# EAGLE design Phiips 212 r2 (EAGLE 9.2.2)
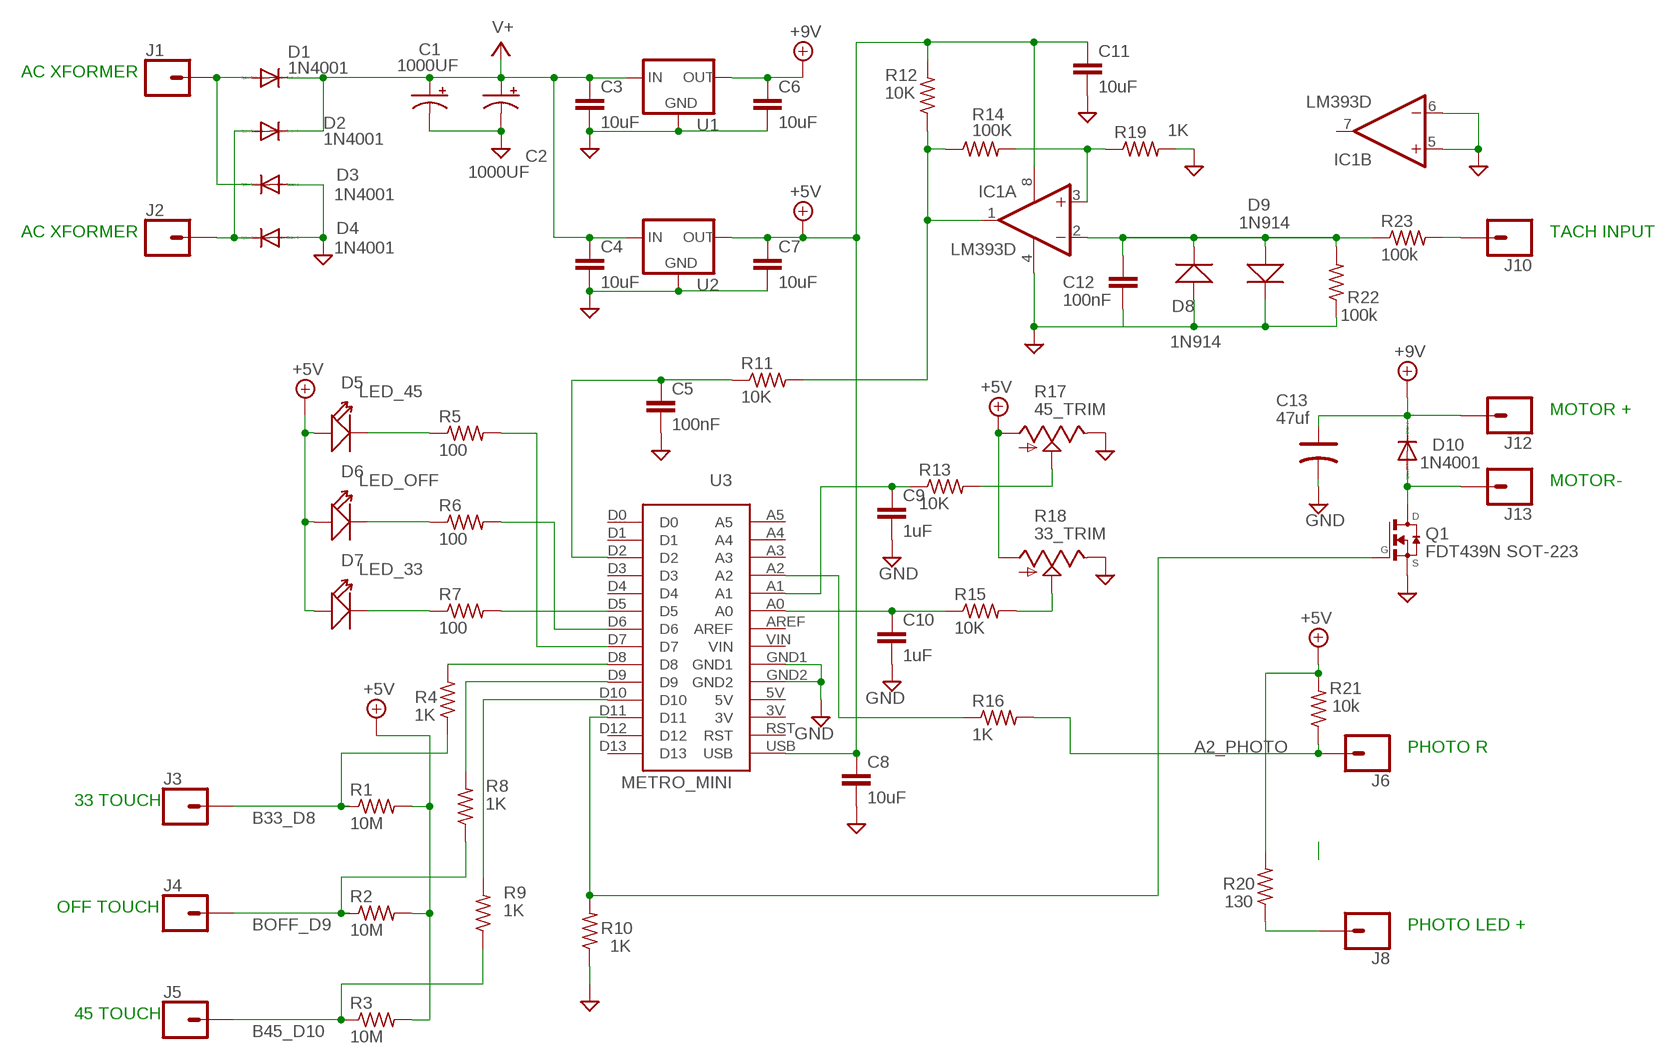
[diagram p0: schematic, sheet 1]

## Parts
C1  1000UF  [CAPPAD1700W60L1040D500P]
C2  1000UF  [CAPPAD1700W60L1040D500P]
C3  10uF  10UF-1206-6.3V-20%  [1206]
C4  10uF  10UF-1206-6.3V-20%  [1206]
C5  100nF  10UF-0805-10V-10%  [0805]
C6  10uF  10UF-1206-6.3V-20%  [1206]
C7  10uF  10UF-1206-6.3V-20%  [1206]
C8  10uF  10UF-1206-6.3V-20%  [1206]
C9  1uF  10UF-1206-6.3V-20%  [1206]
C10  1uF  10UF-1206-6.3V-20%  [1206]
C11  10uF  10UF-1206-6.3V-20%  [1206]
C12  100nF  10UF-0805-10V-10%  [0805]
C13  47uf  TANTALUM-SMD-470UF-6.3V(AVX-D)  [AVX-D]
D1  1N4001  1N4004  [DO41-10]
D2  1N4001  1N4004  [DO41-10]
D3  1N4001  1N4004  [DO41-10]
D4  1N4001  1N4004  [DO41-10]
D5  LED_45  DIP-LED-TRANSPARENT-WHITE(2P-D5MM)  [LED2-2.54-D5.0MM]
D6  LED_OFF  DIP-LED-TRANSPARENT-WHITE(2P-D5MM)  [LED2-2.54-D5.0MM]
D7  LED_33  DIP-LED-TRANSPARENT-WHITE(2P-D5MM)  [LED2-2.54-D5.0MM]
D8  1N914  DIP-DIODE-400V-1A(DO-41)  [DO-41]
D9  1N914  DIP-DIODE-400V-1A(DO-41)  [DO-41]
D10  1N4001  1N4004  [DO41-10]
IC1  LM393D  [SO08]
J1  CONN_01OFFSET  [1X01_OFFSET]
J2  CONN_01OFFSET  [1X01_OFFSET]
J3  CONN_01OFFSET  [1X01_OFFSET]
J4  CONN_01OFFSET  [1X01_OFFSET]
J5  CONN_01OFFSET  [1X01_OFFSET]
J6  CONN_01OFFSET  [1X01_OFFSET]
J8  CONN_01OFFSET  [1X01_OFFSET]
J10  CONN_01OFFSET  [1X01_OFFSET]
J12  CONN_01OFFSET  [1X01_OFFSET]
J13  CONN_01OFFSET  [1X01_OFFSET]
Q1  FDT439N SOT-223  FDT439NSOT-223  [SOT-223]
R1  10M  R-US_M1206  [M1206]
R2  10M  R-US_M1206  [M1206]
R3  10M  R-US_M1206  [M1206]
R4  1K  R-US_M1206  [M1206]
R5  100  R-US_M1206  [M1206]
R6  100  R-US_M1206  [M1206]
R7  100  R-US_M1206  [M1206]
R8  1K  R-US_M1206  [M1206]
R9  1K  R-US_M1206  [M1206]
R10  1K  R-US_M1206  [M1206]
R11  10K  R-US_M1206  [M1206]
R12  10K  R-US_M1206  [M1206]
R13  10K  R-US_M1206  [M1206]
R14  100K  R-US_M1206  [M1206]
R15  10K  R-US_M1206  [M1206]
R16  1K  R-US_M1206  [M1206]
R17  45_TRIM  POTS212_POT  [PH212_POT]
R18  33_TRIM  POTS212_POT  [PH212_POT]
R19  1K  R-US_M1206  [M1206]
R20  130  R-US_M1206  [M1206]
R21  10k  R-US_M1206  [M1206]
R22  100k  R-US_M1206  [M1206]
R23  100k  R-US_M1206  [M1206]
U1  V_REG_78XXSIDE  [78XXL]
U2  V_REG_78XXSIDE  [78XXL]
U3  METRO_MINI  [METRO_MINI]

## Nets
+5V: C7.1 C8.1 C11.1 D5.+ D6.+ D7.+ IC1.8(P:V+) R1.2 R2.2 R3.2 R12.2 R17.1(A) R18.1(A) R20.2 R21.2 U2.OUT U3.USB
+9V: C6.1 C13.+ D10.C J12.1 U1.OUT
A0: R15.2 R18.2(S)
A0N: C10.1 R15.1 U3.A0
A1: R13.2 R17.2(S)
A1N: C9.1 R13.1 U3.A1
A2_PHOTO: J6.1 R16.2 R21.1
B33_D8: J3.1 R1.1 R4.1
B45_D10: J5.1 R3.1 R9.1
BOFF_D9: J4.1 R2.1 R8.1
CIN+: IC1.3(A:+IN) R14.2 R19.1
CIN-: C12.1 D8.2(-) D9.1(+) IC1.2(A:-IN) R22.2 R23.1
CMPOUT: IC1.1(A:OUT) R11.2 R12.1 R14.1
D2: C5.1 R11.1 U3.D2
D8: R4.2 U3.D8
D9: R8.2 U3.D9
D10: R9.2 U3.D10
D10_GATE: Q1.1(G) R10.2 U3.D11
GND: C1.2(-) C2.2(-) C3.2 C4.2 C5.2 C6.2 C7.2 C8.2 C9.2 C10.2 C11.2 C12.2 C13.- D3.A D4.A D8.1(+) D9.2(-) IC1.4(P:V-) IC1.5(B:+IN) IC1.6(B:-IN) Q1.3(S) R10.1 R17.3(E) R18.3(E) R19.2 R22.1 U1.GND U2.GND U3.GND1 U3.GND2
L33: D7.- R7.1
L45: D5.- R5.1
L45_D7: R5.2 U3.D7
LOFF: D6.- R6.1
LOFF_D6: R6.2 U3.D6
MOTR-: D10.A J13.1 Q1.2(D) Q1.4(D)
N$1: R7.2 U3.D5
N$2: R16.1 U3.A2
N$3: J8.1 R20.1
N$4: D1.A D3.C J1.1
N$6: D2.A D4.C J2.1
TACH: J10.1 R23.2
V+: C1.1(+) C2.1(+) C3.1 C4.1 D1.C D2.C U1.IN U2.IN
Unconnected: IC1.7(B:OUT) U3.3V U3.5V U3.A3 U3.A4 U3.A5 U3.AREF U3.D0 U3.D1 U3.D3 U3.D4 U3.D12 U3.D13 U3.RST U3.VIN

## Notes on the sheet
- AC XFORMER
- AC XFORMER | TACH INPUT
- MOTOR +
- MOTOR-
- PHOTO R
- 33 TOUCH
- OFF TOUCH
- PHOTO LED +
- 45 TOUCH

## Library data of the parts
C1 C2 = Bioelec:1000UF: 1,000µF/1mF ceramic capacitors A capacitor is a passive two-terminal electrical component used to store electrical energy temporarily in an electric field. CAP-08070
C3 C4 C6-C8 C11 = SparkFun-Capacitors:10UF: 10.0µF ceramic capacitors A capacitor is a passive two-terminal electrical component used to store electrical energy temporarily in an electric field.; PROD_ID: CAP-10057
C5 C12 = SparkFun-Capacitors:10UF: 10.0µF ceramic capacitors A capacitor is a passive two-terminal electrical component used to store electrical energy temporarily in an electric field.; PROD_ID: CAP-11330; VALUE: 10uF
C9 C10 = SparkFun-Capacitors:10UF: 10.0µF ceramic capacitors A capacitor is a passive two-terminal electrical component used to store electrical energy temporarily in an electric field.; PROD_ID: CAP-10057; VALUE: 10uF
C13 = Seeed-Capacitor:TANTALUM-SMD-470UF-6.3V(AVX-D): 302020027; MPN: TAJD477*006#NJ; VALUE: 470uf
D1-D4 D10 = diode:1N4004: DIODE general purpose rectifier, 1 A
D5-D7 = Seeed-LED:DIP-LED-TRANSPARENT-WHITE(2P-D5MM): 304090058; MPN: 504WC; VALUE: 504WC
D8 D9 = Seeed-Diode:DIP-DIODE-400V-1A(DO-41): 304010008; MPN: 1N4004; VALUE: 1N4004
IC1 = linear:LM393: COMPARATOR
J1-J6 J8 J10 J12 J13 = SparkFun-Connectors:CONN_01: Single connection point. Often used as Generic Header-pin footprint for 0.1 inch spaced/style header connections On any of the 0.1 inch spaced packages, you can populate with these: Break Away Headers - Straight <https://www.sparkfun.com/products/116> (PRT-00116) Break Away Male Headers - Right Angle <https://www.sparkfun.com/products/553> (PRT-00553) Female Headers <https://www.sparkfun.com/products/115> (PRT-00115) Break Away Headers - Machine Pin <https://www.sparkfun.com/products/117> (PRT-00117) Break Away Female Headers - Swiss Machine Pin <https://www.sparkfun.com/products/743> (PRT-00743) This device is also useful as a general connection point to wire up your design to another part of your project. Our various solder wires solder well into these plated through hole pads. Hook-Up Wire - Assortment (Stranded, 22 AWG) <https://www.sparkfun.com/products/11375> (PRT-11375) Hook-Up Wire - Assortment (Solid Core, 22 AWG) <https://www.sparkfun.com/products/11367> (PRT-11367) View the entire wire category on our website here <https://www.sparkfun.com/categories/141> Special notes: SMTSO-256-ET is a "flush mount" nut for a 4-40 screw. We mostly use this on specialty testbeds; it is a nice way to connect hardware to your PCB at an adjustable hieght. Also note, the SNAP packages are for using a snappable style connector. We sell a baggie of snaps and they are also used on two LilyPad designs: Snap Assortment - 30 pack (male and female) <https://www.sparkfun.com/products/11347> (DEV-11347) LilyPad Arduino SimpleSnap <https://www.sparkfun.com/products/10941> (DEV-10941) LilyPad SimpleSnap Protoboard <https://www.sparkfun.com/products/10940> (DEV-10940)
Q1 = Bioelec:FDT439N: N-Channel MOSFET Logic Level Enhancement Mode Field Effect Transistor
R1-R16 R19-R23 = resistor:R-US_: RESISTOR, American symbol
R17 R18 = Len Misc:POTS: Misc potentiometers
U1 U2 = SparkFun-IC-Power:V_REG_78XX: Voltage Regulator Standard 78xx regulator. IGO (Input Ground Output). Spark Fun Electronics SKU : COM-00107
U3 = Len Misc:METRO_MINI: Footprint for Adafruit Metro Mini Arduino compatible board

## Board
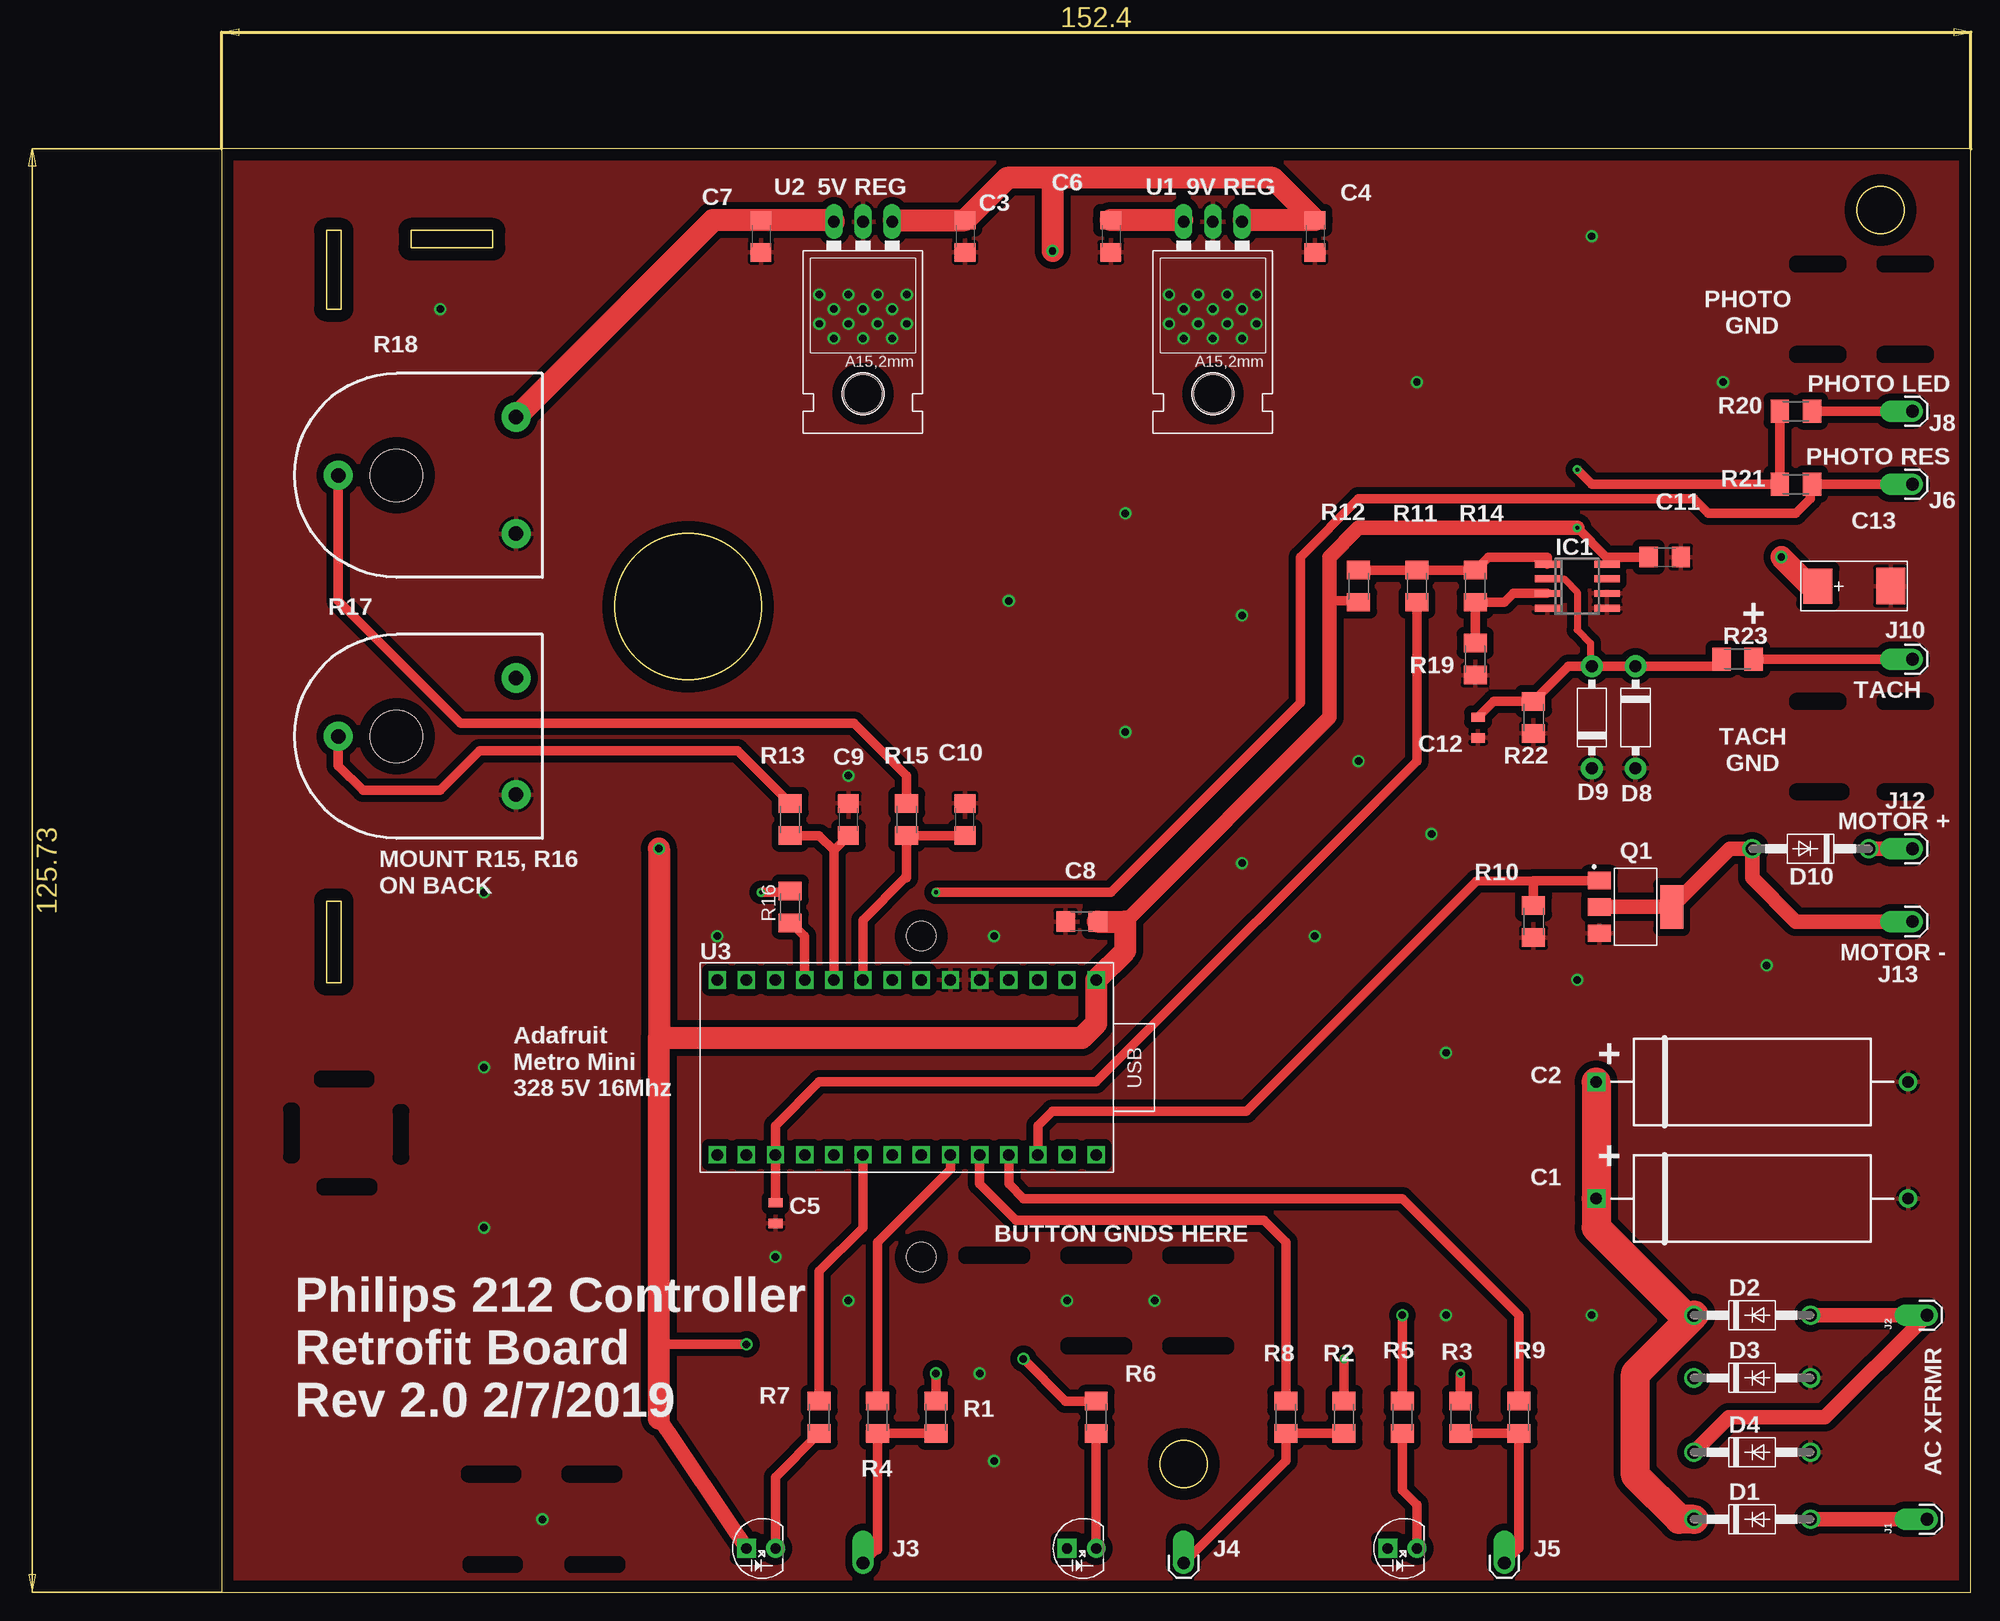
[diagram p1: board, top side]
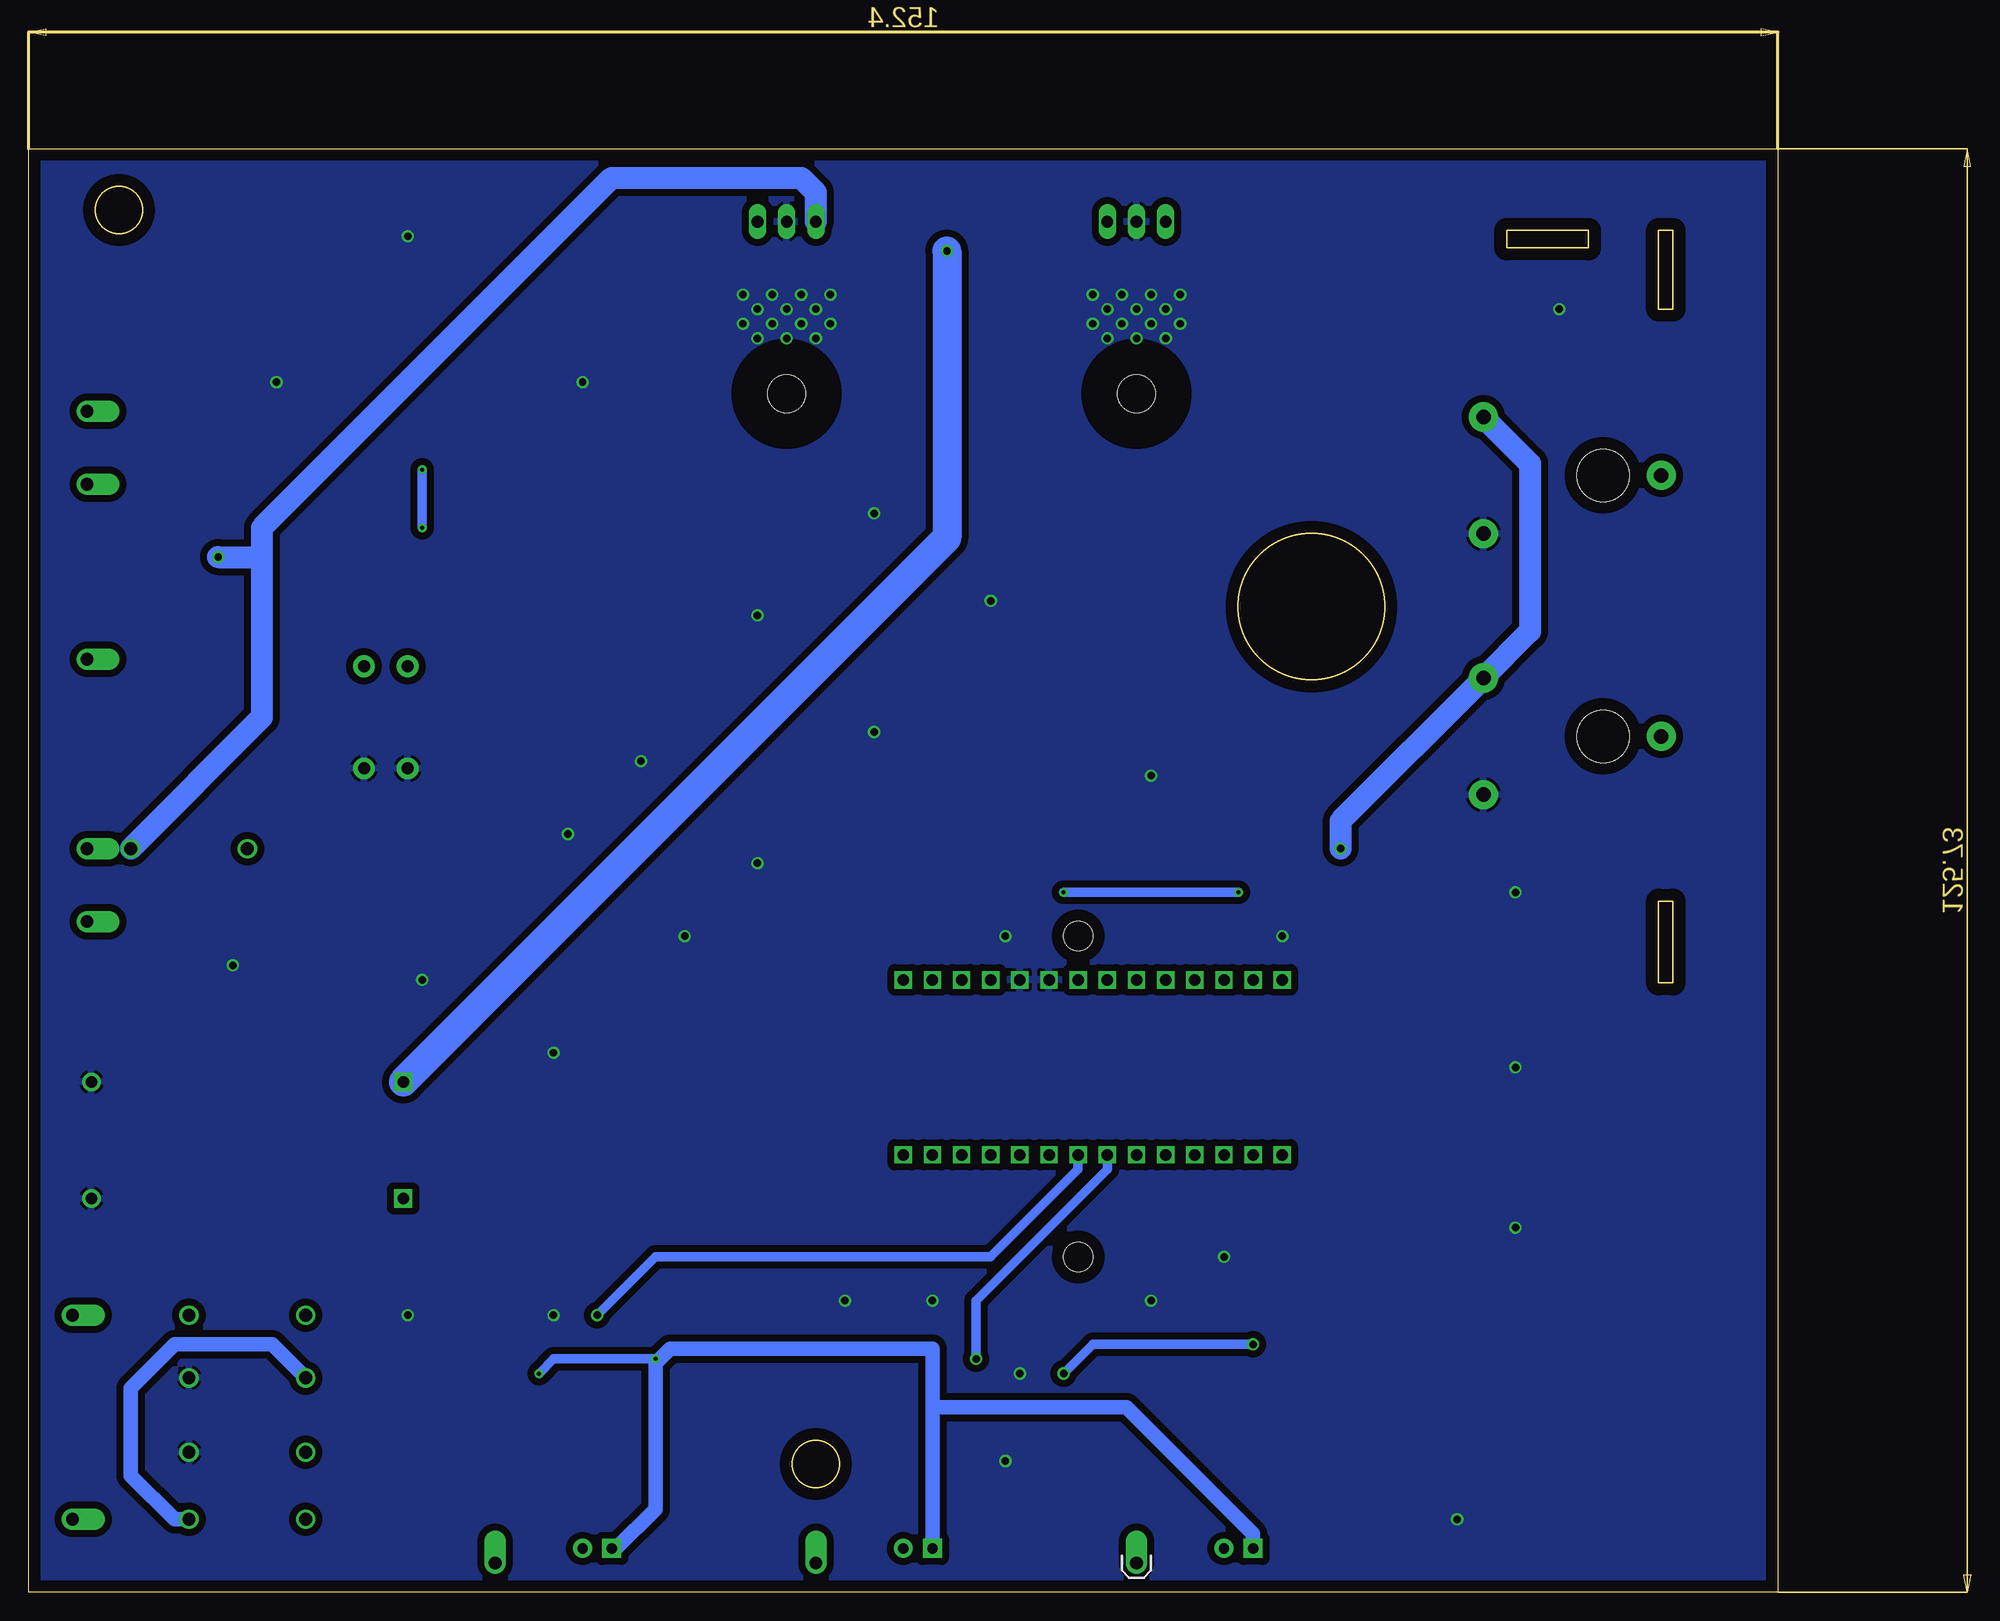
[diagram p2: board, bottom side, seen from below]

Size 152.4 x 125.73 mm. Coordinates in mm from the lower left corner, seen from the top.
Outline: 0,0 152.4,0 152.4,125.73 0,125.73 0,0
Outline: 9.14,118.62 9.14,111.76 10.41,111.76 10.41,118.62 9.14,118.62
Outline: 16.51,118.62 16.51,117.09 23.62,117.09 23.62,118.62 16.51,118.62
Outline: 9.14,60.2 9.14,53.09 10.41,53.09 10.41,60.2 9.14,60.2
Outline: circle at 40.64,85.85 radius 6.35
Outline: circle at 144.53,120.4 radius 2.03
Outline: circle at 83.82,11.18 radius 2.03
Copper layers (1*16): Top 0.035mm / dielectric 1.5mm / Bottom 0.035mm
Design rules "default": minimum track width 6mil, minimum drill 0.35mm, track to track 6mil, track to pad 6mil, pad to pad 6mil, via to via 6mil, smd to smd 6mil, copper to edge 40mil, drill to drill 6mil, minimum pad ring 10mil, minimum via ring 8mil, stop-mask expansion 4mil, vias tented up to drill 0mil, thermal gap 10mil
Holes 4.57 mm at 15.24,97.28 15.24,74.55
Holes 2.54 mm at 60.96,29.21 60.96,57.15
tRestrict: area 144.8,115.6 to 148.6,115.8; area 137.2,115.6 to 141,115.8; area 137.2,107.7 to 141,108; area 144.8,107.7 to 148.6,108; area 144.8,77.5 to 148.6,77.7; area 137.2,77.5 to 141,77.7; area 137.2,69.6 to 141.2,69.8; area 144.8,69.6 to 148.6,69.8; area 82.6,29.2 to 87.6,29.5; area 73.7,29.2 to 78.7,29.5; area 73.7,21.3 to 78.7,21.6; area 82.6,21.3 to 87.6,21.6; area 64.8,29.2 to 69.8,29.5; area 21.6,2.3 to 25.7,2.5; area 30.5,2.3 to 34.5,2.5; area 21.5,10.2 to 25.5,10.4; area 30.2,10.2 to 34.3,10.4; area 8.6,44.6 to 12.7,44.8; area 8.9,35.2 to 13,35.4; area 15.5,37.8 to 15.7,41.9; area 6,38 to 6.2,42

### Footprints (pad centres in the part's own frame; a part is rotated, then mirrored left to right if it is on the bottom)
CAPPAD1700W60L1040D500P = drill 1 pad 1.6 square: 1 -13.58,0 | drill 1 pad 1.6: 2 13.58,0
1206 = smd 1.6 x 1.8: 1 -1.4,0; 2 1.4,0
0805 = smd 0.8 x 1.2: 1 -0.9,0; 2 0.9,0
AVX-D = smd 2.54 x 3.048: + -3.175,0 | smd 2.54 x 3.175: - 3.175,0
DO41-10 = drill 1.118: A 5.08,0; C -5.08,0
LED2-2.54-D5.0MM = drill 0.889 pad 1.651 square: + -1.27,0 | drill 0.889 pad 1.651: - 1.27,0
DO-41 = drill 1.041 pad 1.905: 1 -4.445,0; 2 4.445,0
SO08 = smd 0.6 x 2.2: 1 -1.905,-2.6; 2 -0.635,-2.6; 3 0.635,-2.6; 4 1.905,-2.6; 5 1.905,2.6; 6 0.635,2.6; 7 -0.635,2.6; 8 -1.905,2.6
1X01_OFFSET = drill 1.118 pad 1.88 offset: 1 0,0
SOT-223 = smd 1.5 x 2: 1 -2.3,-3.15; 2 0,-3.15; 3 2.3,-3.15 | smd 3.8 x 2: 4 0,3.15
M1206 = smd 1.6 x 2: 1 -1.4,0; 2 1.4,0
PH212_POT = drill 1.27 pad 2.54: 1 -5.08,10.414; 2 0,-5.08; 3 5.08,10.414
78XXL = drill 1.016 long: GND 0,-3.81; IN -2.54,-3.81; OUT 2.54,-3.81 | hole 3.302: 0,11.176
METRO_MINI = drill 1 square: 3V 11.43,7.62; 5V 8.89,7.62; A0 -3.81,7.62; A1 -6.35,7.62; A2 -8.89,7.62; A3 -11.43,7.62; A4 -13.97,7.62; A5 -16.51,7.62; AREF -1.27,7.62; D0 -16.51,-7.62; D1 -13.97,-7.62; D2 -11.43,-7.62; D3 -8.89,-7.62; D4 -6.35,-7.62; D5 -3.81,-7.62; D6 -1.27,-7.62; D7 1.27,-7.62; D8 3.81,-7.62; D9 6.35,-7.62; D10 8.89,-7.62; D11 11.43,-7.62; D12 13.97,-7.62; D13 16.51,-7.62; GND1 3.81,7.62; GND2 6.35,7.62; RST 13.97,7.62; USB 16.51,7.62; VIN 1.27,7.62

### Placement (x,y rotation side)
C1  133.35,34.29 0 top
C2  133.35,44.45 0 top
C3  64.77,118.11 270 top
C4  95.25,118.11 270 top
C5  48.26,33.02 270 top
C6  77.47,118.11 270 top
C7  46.99,118.11 270 top
C8  74.93,58.42 180 top
C9  54.61,67.31 90 top
C10  64.77,67.31 90 top
C11  125.73,90.17 0 top
C12  109.47,75.31 270 top
C13  142.24,87.63 0 top
D1  133.35,6.35 0 top
D2  133.35,24.13 0 top
D3  133.35,18.67 0 top
D4  133.35,12.19 0 top
D5  102.87,3.81 0 top
D6  74.93,3.81 0 top
D7  46.99,3.81 0 top
D8  123.19,76.2 90 top
D9  119.38,76.2 270 top
D10  138.43,64.77 180 top
IC1  118.11,87.63 270 top
J1  148.59,6.35 90 top
J2  148.59,24.13 90 top
J3  55.88,2.54 0 bottom
J4  83.82,2.54 0 top
J5  111.76,2.54 0 top
J6  147.32,96.52 90 top
J8  147.32,102.87 90 top
J10  147.32,81.28 90 top
J12  147.32,64.77 90 top
J13  147.32,58.42 90 top
Q1  123.19,59.69 270 top
R1  62.23,15.24 90 top
R2  97.79,15.24 90 top
R3  107.95,15.24 90 top
R4  57.15,15.24 90 top
R5  102.87,15.24 90 top
R6  76.2,15.24 90 top
R7  52.07,15.24 90 top
R8  92.71,15.24 90 top
R9  113.03,15.24 90 top
R10  114.3,58.42 90 top
R11  104.14,87.63 90 top
R12  99.06,87.63 270 top
R13  49.53,67.31 90 top
R14  109.22,87.63 270 top
R15  59.69,67.31 90 top
R16  49.53,59.69 90 top
R17  15.24,74.55 270 top
R18  15.24,97.28 270 top
R19  109.22,81.28 270 top
R20  137.16,102.87 180 top
R21  137.16,96.52 180 top
R22  114.3,76.2 90 top
R23  132.08,81.28 0 top
U1  86.36,115.57 180 top
U2  55.88,115.57 180 top
U3  59.69,45.72 0 top

### Tracks (layer width: path | path; a pad name or v marks a point on that pad's centre or on a via)
+5V  (via drill 0.35, 0.65)
  Top 0.61: 120.71,90.11 IC1.8
  Top 0.813: v45.72,21.59 38.1,21.59 | v62.23,19.05 R1.2 | 120.65,90.17 C11.1 | 120.65,90.17 v118.11,92.71 | 120.65,90.17 120.71,90.11 | R12.2 98.93,86.36 96.52,86.36 | R3.2 v107.95,19.05 | R2.2 v97.79,20.32 | R20.2 R21.2 119.38,96.52 v118.11,97.79
  Top 1.27: D7.+ 38.1,15.14 | 78.74,58.42 96.52,76.2 96.52,86.36 96.52,90.17 99.06,92.71 v118.11,92.71
  Top 1.905: 38.1,15.14 38.1,21.59 38.1,48.26 | C8.1 78.74,58.42 78.74,55.88 U3.USB 76.2,49.53 74.93,48.26 38.1,48.26 | U2.OUT 53.21,119.51 C7.1 42.8,119.51 R18.1 | v38.1,64.77 38.1,48.26
  Bottom 0.813: v62.23,19.05 59.69,21.59 v45.72,21.59 | 97.41,20.32 v97.79,20.32 106.68,20.32 v107.95,19.05 | v118.11,97.79 v118.11,92.71
  Bottom 1.27: D5.+ 101.22,3.81 97.79,7.24 97.79,19.94 97.41,20.32 96.52,21.21 73.66,21.21 73.66,16.13 | D6.+ 73.66,16.13 | D7.+ 45.72,5.08 56.77,16.13 73.66,16.13
  Bottom 1.905: R18.1 21.59,98.3 21.59,83.69 R17.1 38.1,67.18 v38.1,64.77
+9V  (via drill 0.65)
  Top 1.27: U1.OUT 83.69,119.51 | J12.1 D10.C
  Top 1.905: 83.69,119.51 C6.1 | C13.+ 138.43,87.63 v135.89,90.17
  Bottom 1.905: D10.C 132.08,76.2 132.08,90.17 | 132.08,90.17 132.08,92.71 101.6,123.19 85.09,123.19 83.82,121.92 U1.OUT | v135.89,90.17 132.08,90.17
A0
  Top 0.813: R18.2 10.16,86.36 20.83,75.69 55.12,75.69 59.69,71.12 R15.2
A0N
  Top 0.813: U3.A0 55.88,58.55 59.56,62.23 59.69,62.23 R15.1 C10.1
A1
  Top 0.813: R13.2 44.96,73.28 22.48,73.28 19.05,69.85 12.32,69.85 10.16,72.01 R17.2
A1N
  Top 0.813: C9.1 53.34,64.64 | U3.A1 53.34,64.64 | 53.34,64.64 52.07,65.91 R13.1
A2_PHOTO  (via drill 0.35)
  Top 0.813: R16.2 49.4,60.96 v46.99,60.96 | v62.23,60.96 77.47,60.96 93.98,77.47 93.98,90.17 99.06,95.25 128.27,95.25 129.54,93.98 137.16,93.98 138.43,95.25 138.43,96.39 R21.1 J6.1
  Bottom 0.813: v46.99,60.96 v62.23,60.96
B33_D8
  Top 0.813: R1.1 R4.1 57.15,3.68 57.02,3.68 J3.1
B45_D10
  Top 0.813: R9.1 113.03,3.81 J5.1 | 113.03,13.97 R9.1 | R3.1 R9.1
BOFF_D9
  Top 0.813: R8.1 92.71,11.43 J4.1 | R8.1 92.71,13.97 | R8.1 R2.1
CIN+
  Top 0.813: IC1.3 112.53,87 111.76,86.23 R14.2 R19.1
CIN-
  Top 0.61: IC1.2 116.97,88.27 118.11,87.12 118.11,83.82 119.25,82.68 119.25,80.65
  Top 0.813: D9.1 D8.2 130.04,80.65 R23.1 | 119.25,80.65 D9.1 | C12.1 110.86,77.6 R22.2 117.34,80.65 D9.1
CMPOUT
  Top 0.813: IC1.1 115.51,90.17 110.36,90.17 R14.1 R11.2 R12.1
D2
  Top 0.813: C5.1 U3.D2 48.26,40.64 52.07,44.45 76.2,44.45 104.14,72.39 R11.1
D8
  Top 0.813: U3.D8 63.5,36.83 57.15,30.48 R4.2
D9
  Top 0.813: U3.D9 66.04,35.56 69.22,32.39 90.81,32.39 92.71,30.48 R8.2
D10
  Top 0.813: U3.D10 68.58,35.56 69.85,34.29 102.87,34.29 113.03,24.13 R9.2
D10_GATE
  Top 0.813: Q1.1 114.3,61.96 | 114.3,61.96 109.31,61.94 89.28,41.91 72.39,41.91 71.12,40.64 U3.D11 | R10.2 114.3,61.96
GND  (via drill 0.65)
  other vias: 22.86,60.96 22.86,45.72 22.86,31.75 27.94,6.35 106.68,24.13 106.68,46.99 88.9,85.09 68.58,86.36 78.74,93.98 99.06,72.39 78.74,74.93 59.69,113.03 104.14,105.41 95.25,57.15 48.26,29.21 54.61,25.4 81.28,25.4 88.9,63.5 105.41,66.04 118.11,53.34 119.38,118.11 130.81,105.41 119.38,24.13 67.31,11.43 54.61,71.12 134.62,54.61 54.61,113.03 57.15,113.03 53.34,111.76 55.88,111.76 58.42,111.76 52.07,113.03 59.69,110.49 54.61,110.49 57.15,110.49 53.34,109.22 55.88,109.22 58.42,109.22 52.07,110.49 85.09,113.03 83.82,111.76 86.36,111.76 82.55,113.03 90.17,110.49 85.09,110.49 87.63,110.49 83.82,109.22 86.36,109.22 88.9,109.22 82.55,110.49 87.63,113.03 90.17,113.03 88.9,111.76 66.04,19.05 73.66,25.4 67.31,57.15 43.18,57.15 19.05,111.76
  pour Top (isolate 0.61): 0,125.73 0,0 152.4,0 152.4,125.73
  pour Bottom (isolate 0.61): 0,125.73 0,0 152.4,0 152.4,125.73
L33
  Top 0.813: R7.1 48.26,10.03 D7.-
L45
  Top 0.813: D5.- 104.14,7.62 102.87,8.89 R5.1
L45_D7  (via drill 0.65)
  Top 0.813: v102.87,24.13 R5.2
  Bottom 0.813: U3.D7 60.96,36.83 68.58,29.21 97.79,29.21 v102.87,24.13
LOFF
  Top 0.813: R6.1 | R6.1 D6.-
LOFF_D6  (via drill 0.65)
  Top 0.813: R6.2 73.53,16.64 v69.85,20.32
  Bottom 0.813: U3.D6 58.42,36.83 69.85,25.4 v69.85,20.32
MOTR-
  Top 1.27: Q1.2 Q1.4 131.42,64.77 D10.A 133.35,62.23 137.16,58.42 J13.1
N$1
  Top 0.813: R7.2 52.07,27.94 55.88,31.75 U3.D5
N$2
  Top 0.813: U3.A2 50.8,57.15 49.66,58.29 R16.1
N$3
  Top 0.813: R20.1 J8.1
N$4
  Top 1.27: D1.A J1.1
  Bottom 1.27: D3.C 131.19,21.59 139.7,21.59 143.51,17.78 143.51,10.16 139.7,6.35 D1.A
N$6
  Top 1.27: D4.C 131.32,15.24 139.7,15.24 J2.1 D2.A
TACH
  Top 0.813: J10.1 R23.2
V+  (via drill 0.65)
  Top 1.27: U1.IN 89.03,119.51 | U2.IN 58.55,119.51
  Top 1.905: 89.03,119.51 C4.1 91.57,123.19 72.39,123.19 | 58.55,119.51 C3.1 68.45,123.19 72.39,123.19 | 72.39,123.19 v72.39,116.84
  Top 2.54: D1.C 127,6.35 123.19,10.16 123.19,19.05 D2.C 127.39,24.13 119.77,31.75 C1.1 C2.1
  Bottom 2.54: C2.1 72.39,91.83 v72.39,116.84

### Text on the board
tNames: 5V REG | 9V REG | PHOTO / GND | PHOTO LED | PHOTO RES | + | TACH | TACH / GND | MOTOR + | MOUNT R15, R16 / ON BACK | MOTOR - | + | Adafruit / Metro Mini / 328 5V 16Mhz | + | BUTTON GNDS HERE | Philips 212 Controller / Retrofit Board / Rev 2.0 2/7/2019 | AC XFRMR